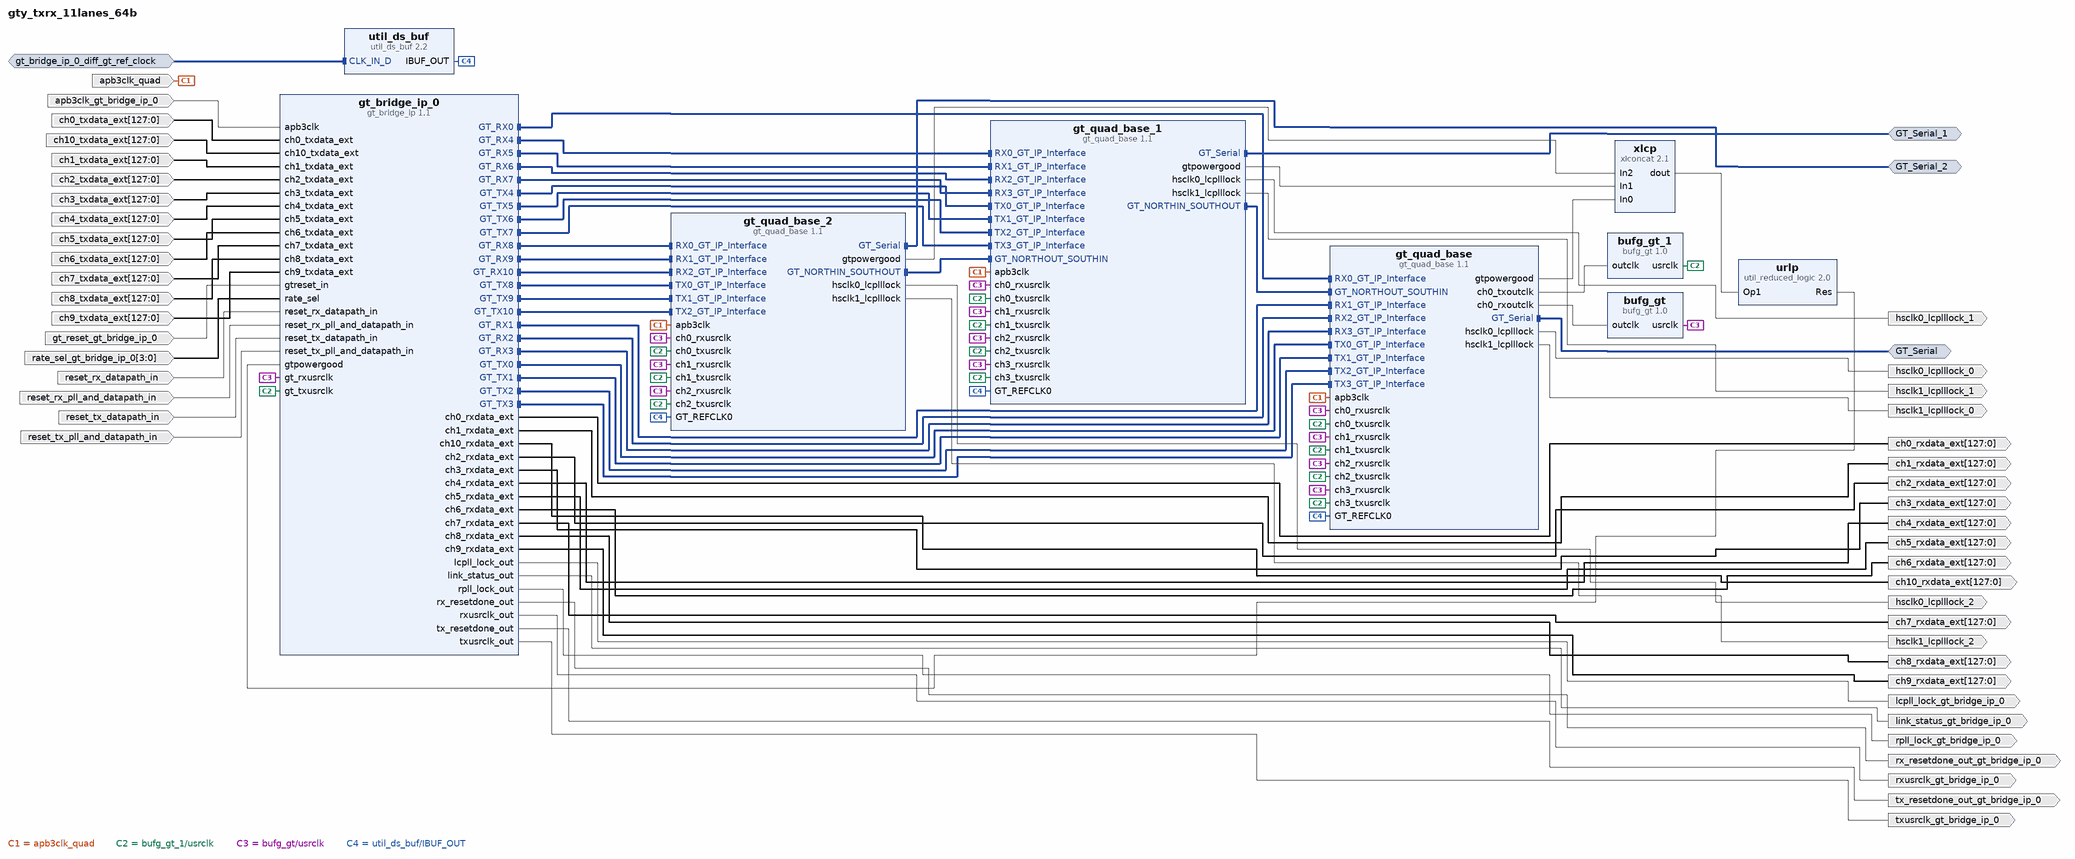
[diagram p0: block diagram of the top level]
# Vivado block design gty_txrx_11lanes_64b, xcvc1902-vsva2197-2MP-e-S, Vivado 2021.1
create_bd_design gty_txrx_11lanes_64b

create_bd_intf_port -mode Slave -vlnv xilinx.com:interface:diff_clock_rtl:1.0 gt_bridge_ip_0_diff_gt_ref_clock
set_property -dict {CONFIG.FREQ_HZ 200000000} [get_bd_intf_ports gt_bridge_ip_0_diff_gt_ref_clock]
create_bd_intf_port -mode Master -vlnv xilinx.com:interface:gt_rtl:1.0 GT_Serial
create_bd_intf_port -mode Master -vlnv xilinx.com:interface:gt_rtl:1.0 GT_Serial_1
create_bd_intf_port -mode Master -vlnv xilinx.com:interface:gt_rtl:1.0 GT_Serial_2
create_bd_port -dir I apb3clk_quad
create_bd_port -dir I gt_reset_gt_bridge_ip_0
create_bd_port -dir O link_status_gt_bridge_ip_0
create_bd_port -dir O txusrclk_gt_bridge_ip_0
create_bd_port -dir O rxusrclk_gt_bridge_ip_0
create_bd_port -dir O rpll_lock_gt_bridge_ip_0
create_bd_port -dir O lcpll_lock_gt_bridge_ip_0
create_bd_port -dir O tx_resetdone_out_gt_bridge_ip_0
create_bd_port -dir O rx_resetdone_out_gt_bridge_ip_0
create_bd_port -dir I -from 3 -to 0 rate_sel_gt_bridge_ip_0
create_bd_port -dir I apb3clk_gt_bridge_ip_0
create_bd_port -dir I reset_rx_pll_and_datapath_in
create_bd_port -dir I reset_rx_datapath_in
create_bd_port -dir I reset_tx_pll_and_datapath_in
create_bd_port -dir I reset_tx_datapath_in
create_bd_port -dir O -from 127 -to 0 ch0_rxdata_ext
create_bd_port -dir I -from 127 -to 0 ch0_txdata_ext
create_bd_port -dir O -from 127 -to 0 ch1_rxdata_ext
create_bd_port -dir I -from 127 -to 0 ch1_txdata_ext
create_bd_port -dir O -from 127 -to 0 ch2_rxdata_ext
create_bd_port -dir I -from 127 -to 0 ch2_txdata_ext
create_bd_port -dir O -from 127 -to 0 ch3_rxdata_ext
create_bd_port -dir I -from 127 -to 0 ch3_txdata_ext
create_bd_port -dir O -from 127 -to 0 ch4_rxdata_ext
create_bd_port -dir I -from 127 -to 0 ch4_txdata_ext
create_bd_port -dir O -from 127 -to 0 ch5_rxdata_ext
create_bd_port -dir I -from 127 -to 0 ch5_txdata_ext
create_bd_port -dir O -from 127 -to 0 ch6_rxdata_ext
create_bd_port -dir I -from 127 -to 0 ch6_txdata_ext
create_bd_port -dir O -from 127 -to 0 ch7_rxdata_ext
create_bd_port -dir I -from 127 -to 0 ch7_txdata_ext
create_bd_port -dir O -from 127 -to 0 ch8_rxdata_ext
create_bd_port -dir I -from 127 -to 0 ch8_txdata_ext
create_bd_port -dir O -from 127 -to 0 ch9_rxdata_ext
create_bd_port -dir I -from 127 -to 0 ch9_txdata_ext
create_bd_port -dir O -from 127 -to 0 ch10_rxdata_ext
create_bd_port -dir I -from 127 -to 0 ch10_txdata_ext
create_bd_port -dir O hsclk0_lcplllock_0
create_bd_port -dir O hsclk1_lcplllock_0
create_bd_port -dir O hsclk0_lcplllock_1
create_bd_port -dir O hsclk1_lcplllock_1
create_bd_port -dir O hsclk0_lcplllock_2
create_bd_port -dir O hsclk1_lcplllock_2

create_bd_cell -type ip -vlnv xilinx.com:ip:gt_bridge_ip:1.1 gt_bridge_ip_0
set_property -dict [list \
  CONFIG.BYPASS_MODE true \
  CONFIG.IP_LR0_SETTINGS {PRESET None RX_PAM_SEL NRZ TX_PAM_SEL NRZ RX_GRAY_BYP true TX_GRAY_BYP true RX_GRAY_LITTLEENDIAN true TX_GRAY_LITTLEENDIAN true RX_PRECODE_BYP true TX_PRECODE_BYP true RX_PRECODE_LITTLEENDIAN false TX_PRECODE_LITTLEENDIAN false INTERNAL_PRESET None GT_TYPE GTY GT_DIRECTION DUPLEX TX_LINE_RATE 12.8 TX_PLL_TYPE LCPLL TX_REFCLK_FREQUENCY 200.0 TX_ACTUAL_REFCLK_FREQUENCY 200.000000000000 TX_FRACN_ENABLED false TX_FRACN_NUMERATOR 0 TX_REFCLK_SOURCE R0 TX_DATA_ENCODING RAW TX_USER_DATA_WIDTH 64 TX_INT_DATA_WIDTH 64 TX_BUFFER_MODE 1 TX_BUFFER_BYPASS_MODE Fast_Sync TX_PIPM_ENABLE false TX_OUTCLK_SOURCE TXOUTCLKPMA TXPROGDIV_FREQ_ENABLE false TXPROGDIV_FREQ_SOURCE LCPLL TXPROGDIV_FREQ_VAL 322.265625 TX_DIFF_SWING_EMPH_MODE CUSTOM TX_64B66B_SCRAMBLER false TX_64B66B_ENCODER false TX_64B66B_CRC false TX_RATE_GROUP A RX_LINE_RATE 12.8 RX_PLL_TYPE LCPLL RX_REFCLK_FREQUENCY 200.0 RX_ACTUAL_REFCLK_FREQUENCY 200.000000000000 RX_FRACN_ENABLED false RX_FRACN_NUMERATOR 0 RX_REFCLK_SOURCE R0 RX_DATA_DECODING RAW RX_USER_DATA_WIDTH 64 RX_INT_DATA_WIDTH 64 RX_BUFFER_MODE 1 RX_OUTCLK_SOURCE RXOUTCLKPMA RXPROGDIV_FREQ_ENABLE false RXPROGDIV_FREQ_SOURCE LCPLL RXPROGDIV_FREQ_VAL 322.265625 INS_LOSS_NYQ 20 RX_EQ_MODE AUTO RX_COUPLING AC RX_TERMINATION PROGRAMMABLE RX_RATE_GROUP A RX_TERMINATION_PROG_VALUE 800 RX_PPM_OFFSET 0 RX_64B66B_DESCRAMBLER false RX_64B66B_DECODER false RX_64B66B_CRC false OOB_ENABLE false RX_COMMA_ALIGN_WORD 1 RX_COMMA_SHOW_REALIGN_ENABLE true PCIE_ENABLE false TX_LANE_DESKEW_HDMI_ENABLE false RX_COMMA_P_ENABLE false RX_COMMA_M_ENABLE false RX_COMMA_DOUBLE_ENABLE false RX_COMMA_P_VAL 0101111100 RX_COMMA_M_VAL 1010000011 RX_COMMA_MASK 0000000000 RX_SLIDE_MODE OFF RX_SSC_PPM 0 RX_CB_NUM_SEQ 0 RX_CB_LEN_SEQ 1 RX_CB_MAX_SKEW 1 RX_CB_MAX_LEVEL 1 RX_CB_MASK_0_0 false RX_CB_VAL_0_0 00000000 RX_CB_K_0_0 false RX_CB_DISP_0_0 false RX_CB_MASK_0_1 false RX_CB_VAL_0_1 00000000 RX_CB_K_0_1 false RX_CB_DISP_0_1 false RX_CB_MASK_0_2 false RX_CB_VAL_0_2 00000000 RX_CB_K_0_2 false RX_CB_DISP_0_2 false RX_CB_MASK_0_3 false RX_CB_VAL_0_3 00000000 RX_CB_K_0_3 false RX_CB_DISP_0_3 false RX_CB_MASK_1_0 false RX_CB_VAL_1_0 00000000 RX_CB_K_1_0 false RX_CB_DISP_1_0 false RX_CB_MASK_1_1 false RX_CB_VAL_1_1 00000000 RX_CB_K_1_1 false RX_CB_DISP_1_1 false RX_CB_MASK_1_2 false RX_CB_VAL_1_2 00000000 RX_CB_K_1_2 false RX_CB_DISP_1_2 false RX_CB_MASK_1_3 false RX_CB_VAL_1_3 00000000 RX_CB_K_1_3 false RX_CB_DISP_1_3 false RX_CC_NUM_SEQ 0 RX_CC_LEN_SEQ 1 RX_CC_PERIODICITY 5000 RX_CC_KEEP_IDLE DISABLE RX_CC_PRECEDENCE ENABLE RX_CC_REPEAT_WAIT 0 RX_CC_VAL 00000000000000000000000000000000000000000000000000000000000000000000000000000000 RX_CC_MASK_0_0 false RX_CC_VAL_0_0 00000000 RX_CC_K_0_0 false RX_CC_DISP_0_0 false RX_CC_MASK_0_1 false RX_CC_VAL_0_1 00000000 RX_CC_K_0_1 false RX_CC_DISP_0_1 false RX_CC_MASK_0_2 false RX_CC_VAL_0_2 00000000 RX_CC_K_0_2 false RX_CC_DISP_0_2 false RX_CC_MASK_0_3 false RX_CC_VAL_0_3 00000000 RX_CC_K_0_3 false RX_CC_DISP_0_3 false RX_CC_MASK_1_0 false RX_CC_VAL_1_0 00000000 RX_CC_K_1_0 false RX_CC_DISP_1_0 false RX_CC_MASK_1_1 false RX_CC_VAL_1_1 00000000 RX_CC_K_1_1 false RX_CC_DISP_1_1 false RX_CC_MASK_1_2 false RX_CC_VAL_1_2 00000000 RX_CC_K_1_2 false RX_CC_DISP_1_2 false RX_CC_MASK_1_3 false RX_CC_VAL_1_3 00000000 RX_CC_K_1_3 false RX_CC_DISP_1_3 false PCIE_USERCLK2_FREQ 250 PCIE_USERCLK_FREQ 250 RX_JTOL_FC 7.6784643 RX_JTOL_LF_SLOPE -20 RX_BUFFER_BYPASS_MODE Fast_Sync RX_BUFFER_BYPASS_MODE_LANE MULTI RX_BUFFER_RESET_ON_CB_CHANGE ENABLE RX_BUFFER_RESET_ON_COMMAALIGN DISABLE RX_BUFFER_RESET_ON_RATE_CHANGE ENABLE TX_BUFFER_RESET_ON_RATE_CHANGE ENABLE RESET_SEQUENCE_INTERVAL 0 RX_COMMA_PRESET NONE RX_COMMA_VALID_ONLY 0 } \
  CONFIG.IP_NO_OF_LANES 11 \
] [get_bd_cells gt_bridge_ip_0]
create_bd_cell -type ip -vlnv xilinx.com:ip:gt_quad_base:1.1 gt_quad_base
set_property -dict [list \
  CONFIG.PORTS_INFO_DICT {LANE_SEL_DICT {PROT0 {RX0 RX1 RX2 RX3 TX0 TX1 TX2 TX3}} GT_TYPE GTY REG_CONF_INTF APB3_INTF BOARD_PARAMETER { }} \
  CONFIG.QUAD_USAGE {TX_QUAD_CH {TXQuad_0_/gt_quad_base {/gt_quad_base gty_txrx_11lanes_64b_gt_bridge_ip_0_0.IP_CH0,gty_txrx_11lanes_64b_gt_bridge_ip_0_0.IP_CH1,gty_txrx_11lanes_64b_gt_bridge_ip_0_0.IP_CH2,gty_txrx_11lanes_64b_gt_bridge_ip_0_0.IP_CH3 MSTRCLK 1,0,0,0 IS_CURRENT_QUAD 1} TXQuad_1_/gt_quad_base_1 {/gt_quad_base_1 gty_txrx_11lanes_64b_gt_bridge_ip_0_0.IP_CH4,gty_txrx_11lanes_64b_gt_bridge_ip_0_0.IP_CH5,gty_txrx_11lanes_64b_gt_bridge_ip_0_0.IP_CH6,gty_txrx_11lanes_64b_gt_bridge_ip_0_0.IP_CH7 MSTRCLK 0,0,0,0 IS_CURRENT_QUAD 0} TXQuad_2_/gt_quad_base_2 {/gt_quad_base_2 gty_txrx_11lanes_64b_gt_bridge_ip_0_0.IP_CH8,gty_txrx_11lanes_64b_gt_bridge_ip_0_0.IP_CH9,gty_txrx_11lanes_64b_gt_bridge_ip_0_0.IP_CH10,undef MSTRCLK 0,0,0,0 IS_CURRENT_QUAD 0}} RX_QUAD_CH {RXQuad_0_/gt_quad_base {/gt_quad_base gty_txrx_11lanes_64b_gt_bridge_ip_0_0.IP_CH0,gty_txrx_11lanes_64b_gt_bridge_ip_0_0.IP_CH1,gty_txrx_11lanes_64b_gt_bridge_ip_0_0.IP_CH2,gty_txrx_11lanes_64b_gt_bridge_ip_0_0.IP_CH3 MSTRCLK 1,0,0,0 IS_CURRENT_QUAD 1} RXQuad_1_/gt_quad_base_1 {/gt_quad_base_1 gty_txrx_11lanes_64b_gt_bridge_ip_0_0.IP_CH4,gty_txrx_11lanes_64b_gt_bridge_ip_0_0.IP_CH5,gty_txrx_11lanes_64b_gt_bridge_ip_0_0.IP_CH6,gty_txrx_11lanes_64b_gt_bridge_ip_0_0.IP_CH7 MSTRCLK 0,0,0,0 IS_CURRENT_QUAD 0} RXQuad_2_/gt_quad_base_2 {/gt_quad_base_2 gty_txrx_11lanes_64b_gt_bridge_ip_0_0.IP_CH8,gty_txrx_11lanes_64b_gt_bridge_ip_0_0.IP_CH9,gty_txrx_11lanes_64b_gt_bridge_ip_0_0.IP_CH10,undef MSTRCLK 0,0,0,0 IS_CURRENT_QUAD 0}}} \
  CONFIG.REFCLK_STRING {HSCLK0_LCPLLGTREFCLK0 refclk_PROT0_R0_200_MHz_unique1 HSCLK1_LCPLLGTREFCLK0 refclk_PROT0_R0_200_MHz_unique1} \
] [get_bd_cells gt_quad_base]
create_bd_cell -type ip -vlnv xilinx.com:ip:gt_quad_base:1.1 gt_quad_base_1
set_property -dict [list \
  CONFIG.PORTS_INFO_DICT {LANE_SEL_DICT {PROT0 {RX0 RX1 RX2 RX3 TX0 TX1 TX2 TX3}} GT_TYPE GTY REG_CONF_INTF APB3_INTF BOARD_PARAMETER { }} \
  CONFIG.QUAD_USAGE {TX_QUAD_CH {TXQuad_-1_/gt_quad_base {/gt_quad_base gty_txrx_11lanes_64b_gt_bridge_ip_0_0.IP_CH0,gty_txrx_11lanes_64b_gt_bridge_ip_0_0.IP_CH1,gty_txrx_11lanes_64b_gt_bridge_ip_0_0.IP_CH2,gty_txrx_11lanes_64b_gt_bridge_ip_0_0.IP_CH3 MSTRCLK 1,0,0,0 IS_CURRENT_QUAD 0} TXQuad_0_/gt_quad_base_1 {/gt_quad_base_1 gty_txrx_11lanes_64b_gt_bridge_ip_0_0.IP_CH4,gty_txrx_11lanes_64b_gt_bridge_ip_0_0.IP_CH5,gty_txrx_11lanes_64b_gt_bridge_ip_0_0.IP_CH6,gty_txrx_11lanes_64b_gt_bridge_ip_0_0.IP_CH7 MSTRCLK 0,0,0,0 IS_CURRENT_QUAD 1} TXQuad_1_/gt_quad_base_2 {/gt_quad_base_2 gty_txrx_11lanes_64b_gt_bridge_ip_0_0.IP_CH8,gty_txrx_11lanes_64b_gt_bridge_ip_0_0.IP_CH9,gty_txrx_11lanes_64b_gt_bridge_ip_0_0.IP_CH10,undef MSTRCLK 0,0,0,0 IS_CURRENT_QUAD 0}} RX_QUAD_CH {RXQuad_-1_/gt_quad_base {/gt_quad_base gty_txrx_11lanes_64b_gt_bridge_ip_0_0.IP_CH0,gty_txrx_11lanes_64b_gt_bridge_ip_0_0.IP_CH1,gty_txrx_11lanes_64b_gt_bridge_ip_0_0.IP_CH2,gty_txrx_11lanes_64b_gt_bridge_ip_0_0.IP_CH3 MSTRCLK 1,0,0,0 IS_CURRENT_QUAD 0} RXQuad_0_/gt_quad_base_1 {/gt_quad_base_1 gty_txrx_11lanes_64b_gt_bridge_ip_0_0.IP_CH4,gty_txrx_11lanes_64b_gt_bridge_ip_0_0.IP_CH5,gty_txrx_11lanes_64b_gt_bridge_ip_0_0.IP_CH6,gty_txrx_11lanes_64b_gt_bridge_ip_0_0.IP_CH7 MSTRCLK 0,0,0,0 IS_CURRENT_QUAD 1} RXQuad_1_/gt_quad_base_2 {/gt_quad_base_2 gty_txrx_11lanes_64b_gt_bridge_ip_0_0.IP_CH8,gty_txrx_11lanes_64b_gt_bridge_ip_0_0.IP_CH9,gty_txrx_11lanes_64b_gt_bridge_ip_0_0.IP_CH10,undef MSTRCLK 0,0,0,0 IS_CURRENT_QUAD 0}}} \
  CONFIG.REFCLK_STRING {HSCLK0_LCPLLGTREFCLK0 refclk_PROT0_R0_200_MHz_unique1 HSCLK1_LCPLLGTREFCLK0 refclk_PROT0_R0_200_MHz_unique1} \
] [get_bd_cells gt_quad_base_1]
create_bd_cell -type ip -vlnv xilinx.com:ip:gt_quad_base:1.1 gt_quad_base_2
set_property -dict [list \
  CONFIG.PORTS_INFO_DICT {LANE_SEL_DICT {PROT0 {RX0 RX1 RX2 TX0 TX1 TX2} unconnected {RX3 TX3}} GT_TYPE GTY REG_CONF_INTF APB3_INTF BOARD_PARAMETER { }} \
  CONFIG.QUAD_USAGE {TX_QUAD_CH {TXQuad_-2_/gt_quad_base {/gt_quad_base gty_txrx_11lanes_64b_gt_bridge_ip_0_0.IP_CH0,gty_txrx_11lanes_64b_gt_bridge_ip_0_0.IP_CH1,gty_txrx_11lanes_64b_gt_bridge_ip_0_0.IP_CH2,gty_txrx_11lanes_64b_gt_bridge_ip_0_0.IP_CH3 MSTRCLK 1,0,0,0 IS_CURRENT_QUAD 0} TXQuad_-1_/gt_quad_base_1 {/gt_quad_base_1 gty_txrx_11lanes_64b_gt_bridge_ip_0_0.IP_CH4,gty_txrx_11lanes_64b_gt_bridge_ip_0_0.IP_CH5,gty_txrx_11lanes_64b_gt_bridge_ip_0_0.IP_CH6,gty_txrx_11lanes_64b_gt_bridge_ip_0_0.IP_CH7 MSTRCLK 0,0,0,0 IS_CURRENT_QUAD 0} TXQuad_0_/gt_quad_base_2 {/gt_quad_base_2 gty_txrx_11lanes_64b_gt_bridge_ip_0_0.IP_CH8,gty_txrx_11lanes_64b_gt_bridge_ip_0_0.IP_CH9,gty_txrx_11lanes_64b_gt_bridge_ip_0_0.IP_CH10,undef MSTRCLK 0,0,0,0 IS_CURRENT_QUAD 1}} RX_QUAD_CH {RXQuad_-2_/gt_quad_base {/gt_quad_base gty_txrx_11lanes_64b_gt_bridge_ip_0_0.IP_CH0,gty_txrx_11lanes_64b_gt_bridge_ip_0_0.IP_CH1,gty_txrx_11lanes_64b_gt_bridge_ip_0_0.IP_CH2,gty_txrx_11lanes_64b_gt_bridge_ip_0_0.IP_CH3 MSTRCLK 1,0,0,0 IS_CURRENT_QUAD 0} RXQuad_-1_/gt_quad_base_1 {/gt_quad_base_1 gty_txrx_11lanes_64b_gt_bridge_ip_0_0.IP_CH4,gty_txrx_11lanes_64b_gt_bridge_ip_0_0.IP_CH5,gty_txrx_11lanes_64b_gt_bridge_ip_0_0.IP_CH6,gty_txrx_11lanes_64b_gt_bridge_ip_0_0.IP_CH7 MSTRCLK 0,0,0,0 IS_CURRENT_QUAD 0} RXQuad_0_/gt_quad_base_2 {/gt_quad_base_2 gty_txrx_11lanes_64b_gt_bridge_ip_0_0.IP_CH8,gty_txrx_11lanes_64b_gt_bridge_ip_0_0.IP_CH9,gty_txrx_11lanes_64b_gt_bridge_ip_0_0.IP_CH10,undef MSTRCLK 0,0,0,0 IS_CURRENT_QUAD 1}}} \
  CONFIG.REFCLK_STRING {HSCLK0_LCPLLGTREFCLK0 refclk_PROT0_R0_200_MHz_unique1 HSCLK1_LCPLLGTREFCLK0 refclk_PROT0_R0_200_MHz_unique1} \
] [get_bd_cells gt_quad_base_2]
create_bd_cell -type ip -vlnv xilinx.com:ip:bufg_gt:1.0 bufg_gt
create_bd_cell -type ip -vlnv xilinx.com:ip:bufg_gt:1.0 bufg_gt_1
create_bd_cell -type ip -vlnv xilinx.com:ip:util_reduced_logic:2.0 urlp
set_property -dict {CONFIG.C_SIZE 3} [get_bd_cells urlp]
create_bd_cell -type ip -vlnv xilinx.com:ip:xlconcat:2.1 xlcp
set_property -dict {CONFIG.NUM_PORTS 3} [get_bd_cells xlcp]
create_bd_cell -type ip -vlnv xilinx.com:ip:util_ds_buf:2.2 util_ds_buf
set_property -dict {CONFIG.C_BUF_TYPE IBUFDSGTE} [get_bd_cells util_ds_buf]

# ---- connections ----

connect_bd_intf_net [get_bd_intf_pins gt_bridge_ip_0/GT_RX0] [get_bd_intf_pins gt_quad_base/RX0_GT_IP_Interface]
connect_bd_intf_net [get_bd_intf_pins gt_bridge_ip_0/GT_RX1] [get_bd_intf_pins gt_quad_base/RX1_GT_IP_Interface]
connect_bd_intf_net [get_bd_intf_pins gt_bridge_ip_0/GT_RX2] [get_bd_intf_pins gt_quad_base/RX2_GT_IP_Interface]
connect_bd_intf_net [get_bd_intf_pins gt_bridge_ip_0/GT_RX3] [get_bd_intf_pins gt_quad_base/RX3_GT_IP_Interface]
connect_bd_intf_net [get_bd_intf_pins gt_bridge_ip_0/GT_RX4] [get_bd_intf_pins gt_quad_base_1/RX0_GT_IP_Interface]
connect_bd_intf_net [get_bd_intf_pins gt_bridge_ip_0/GT_RX5] [get_bd_intf_pins gt_quad_base_1/RX1_GT_IP_Interface]
connect_bd_intf_net [get_bd_intf_pins gt_bridge_ip_0/GT_RX6] [get_bd_intf_pins gt_quad_base_1/RX2_GT_IP_Interface]
connect_bd_intf_net [get_bd_intf_pins gt_bridge_ip_0/GT_RX7] [get_bd_intf_pins gt_quad_base_1/RX3_GT_IP_Interface]
connect_bd_intf_net [get_bd_intf_pins gt_bridge_ip_0/GT_RX8] [get_bd_intf_pins gt_quad_base_2/RX0_GT_IP_Interface]
connect_bd_intf_net [get_bd_intf_pins gt_bridge_ip_0/GT_RX9] [get_bd_intf_pins gt_quad_base_2/RX1_GT_IP_Interface]
connect_bd_intf_net [get_bd_intf_pins gt_bridge_ip_0/GT_RX10] [get_bd_intf_pins gt_quad_base_2/RX2_GT_IP_Interface]
connect_bd_intf_net [get_bd_intf_pins gt_bridge_ip_0/GT_TX0] [get_bd_intf_pins gt_quad_base/TX0_GT_IP_Interface]
connect_bd_intf_net [get_bd_intf_pins gt_bridge_ip_0/GT_TX1] [get_bd_intf_pins gt_quad_base/TX1_GT_IP_Interface]
connect_bd_intf_net [get_bd_intf_pins gt_bridge_ip_0/GT_TX2] [get_bd_intf_pins gt_quad_base/TX2_GT_IP_Interface]
connect_bd_intf_net [get_bd_intf_pins gt_bridge_ip_0/GT_TX3] [get_bd_intf_pins gt_quad_base/TX3_GT_IP_Interface]
connect_bd_intf_net [get_bd_intf_pins gt_bridge_ip_0/GT_TX4] [get_bd_intf_pins gt_quad_base_1/TX0_GT_IP_Interface]
connect_bd_intf_net [get_bd_intf_pins gt_bridge_ip_0/GT_TX5] [get_bd_intf_pins gt_quad_base_1/TX1_GT_IP_Interface]
connect_bd_intf_net [get_bd_intf_pins gt_bridge_ip_0/GT_TX6] [get_bd_intf_pins gt_quad_base_1/TX2_GT_IP_Interface]
connect_bd_intf_net [get_bd_intf_pins gt_bridge_ip_0/GT_TX7] [get_bd_intf_pins gt_quad_base_1/TX3_GT_IP_Interface]
connect_bd_intf_net [get_bd_intf_pins gt_bridge_ip_0/GT_TX8] [get_bd_intf_pins gt_quad_base_2/TX0_GT_IP_Interface]
connect_bd_intf_net [get_bd_intf_pins gt_bridge_ip_0/GT_TX9] [get_bd_intf_pins gt_quad_base_2/TX1_GT_IP_Interface]
connect_bd_intf_net [get_bd_intf_pins gt_bridge_ip_0/GT_TX10] [get_bd_intf_pins gt_quad_base_2/TX2_GT_IP_Interface]
connect_bd_intf_net [get_bd_intf_ports gt_bridge_ip_0_diff_gt_ref_clock] [get_bd_intf_pins util_ds_buf/CLK_IN_D]
connect_bd_intf_net [get_bd_intf_pins gt_quad_base/GT_NORTHOUT_SOUTHIN] [get_bd_intf_pins gt_quad_base_1/GT_NORTHIN_SOUTHOUT]
connect_bd_intf_net [get_bd_intf_ports GT_Serial_1] [get_bd_intf_pins gt_quad_base_1/GT_Serial]
connect_bd_intf_net [get_bd_intf_pins gt_quad_base_1/GT_NORTHOUT_SOUTHIN] [get_bd_intf_pins gt_quad_base_2/GT_NORTHIN_SOUTHOUT]
connect_bd_intf_net [get_bd_intf_ports GT_Serial_2] [get_bd_intf_pins gt_quad_base_2/GT_Serial]
connect_bd_intf_net [get_bd_intf_ports GT_Serial] [get_bd_intf_pins gt_quad_base/GT_Serial]
connect_bd_net -net apb3clk_gt_bridge_ip_0_1 [get_bd_ports apb3clk_gt_bridge_ip_0] [get_bd_pins gt_bridge_ip_0/apb3clk]
connect_bd_net [get_bd_ports apb3clk_quad] \
  [get_bd_pins gt_quad_base/apb3clk] [get_bd_pins gt_quad_base_1/apb3clk] [get_bd_pins gt_quad_base_2/apb3clk]
connect_bd_net [get_bd_pins bufg_gt_1/usrclk] \
  [get_bd_pins gt_bridge_ip_0/gt_txusrclk] [get_bd_pins gt_quad_base/ch0_txusrclk] [get_bd_pins gt_quad_base/ch1_txusrclk] \
  [get_bd_pins gt_quad_base/ch2_txusrclk] [get_bd_pins gt_quad_base/ch3_txusrclk] [get_bd_pins gt_quad_base_1/ch0_txusrclk] \
  [get_bd_pins gt_quad_base_1/ch1_txusrclk] [get_bd_pins gt_quad_base_1/ch2_txusrclk] \
  [get_bd_pins gt_quad_base_1/ch3_txusrclk] [get_bd_pins gt_quad_base_2/ch0_txusrclk] \
  [get_bd_pins gt_quad_base_2/ch1_txusrclk] [get_bd_pins gt_quad_base_2/ch2_txusrclk]
connect_bd_net [get_bd_pins bufg_gt/usrclk] \
  [get_bd_pins gt_bridge_ip_0/gt_rxusrclk] [get_bd_pins gt_quad_base/ch0_rxusrclk] [get_bd_pins gt_quad_base/ch1_rxusrclk] \
  [get_bd_pins gt_quad_base/ch2_rxusrclk] [get_bd_pins gt_quad_base/ch3_rxusrclk] [get_bd_pins gt_quad_base_1/ch0_rxusrclk] \
  [get_bd_pins gt_quad_base_1/ch1_rxusrclk] [get_bd_pins gt_quad_base_1/ch2_rxusrclk] \
  [get_bd_pins gt_quad_base_1/ch3_rxusrclk] [get_bd_pins gt_quad_base_2/ch0_rxusrclk] \
  [get_bd_pins gt_quad_base_2/ch1_rxusrclk] [get_bd_pins gt_quad_base_2/ch2_rxusrclk]
connect_bd_net [get_bd_ports ch0_txdata_ext] [get_bd_pins gt_bridge_ip_0/ch0_txdata_ext]
connect_bd_net [get_bd_ports ch10_txdata_ext] [get_bd_pins gt_bridge_ip_0/ch10_txdata_ext]
connect_bd_net [get_bd_ports ch1_txdata_ext] [get_bd_pins gt_bridge_ip_0/ch1_txdata_ext]
connect_bd_net [get_bd_ports ch2_txdata_ext] [get_bd_pins gt_bridge_ip_0/ch2_txdata_ext]
connect_bd_net [get_bd_ports ch3_txdata_ext] [get_bd_pins gt_bridge_ip_0/ch3_txdata_ext]
connect_bd_net [get_bd_ports ch4_txdata_ext] [get_bd_pins gt_bridge_ip_0/ch4_txdata_ext]
connect_bd_net [get_bd_ports ch5_txdata_ext] [get_bd_pins gt_bridge_ip_0/ch5_txdata_ext]
connect_bd_net [get_bd_ports ch6_txdata_ext] [get_bd_pins gt_bridge_ip_0/ch6_txdata_ext]
connect_bd_net [get_bd_ports ch7_txdata_ext] [get_bd_pins gt_bridge_ip_0/ch7_txdata_ext]
connect_bd_net [get_bd_ports ch8_txdata_ext] [get_bd_pins gt_bridge_ip_0/ch8_txdata_ext]
connect_bd_net [get_bd_ports ch9_txdata_ext] [get_bd_pins gt_bridge_ip_0/ch9_txdata_ext]
connect_bd_net [get_bd_pins gt_bridge_ip_0/ch0_rxdata_ext] [get_bd_ports ch0_rxdata_ext]
connect_bd_net [get_bd_pins gt_bridge_ip_0/ch10_rxdata_ext] [get_bd_ports ch10_rxdata_ext]
connect_bd_net [get_bd_pins gt_bridge_ip_0/ch1_rxdata_ext] [get_bd_ports ch1_rxdata_ext]
connect_bd_net [get_bd_pins gt_bridge_ip_0/ch2_rxdata_ext] [get_bd_ports ch2_rxdata_ext]
connect_bd_net [get_bd_pins gt_bridge_ip_0/ch3_rxdata_ext] [get_bd_ports ch3_rxdata_ext]
connect_bd_net [get_bd_pins gt_bridge_ip_0/ch4_rxdata_ext] [get_bd_ports ch4_rxdata_ext]
connect_bd_net [get_bd_pins gt_bridge_ip_0/ch5_rxdata_ext] [get_bd_ports ch5_rxdata_ext]
connect_bd_net [get_bd_pins gt_bridge_ip_0/ch6_rxdata_ext] [get_bd_ports ch6_rxdata_ext]
connect_bd_net [get_bd_pins gt_bridge_ip_0/ch7_rxdata_ext] [get_bd_ports ch7_rxdata_ext]
connect_bd_net [get_bd_pins gt_bridge_ip_0/ch8_rxdata_ext] [get_bd_ports ch8_rxdata_ext]
connect_bd_net [get_bd_pins gt_bridge_ip_0/ch9_rxdata_ext] [get_bd_ports ch9_rxdata_ext]
connect_bd_net [get_bd_pins gt_bridge_ip_0/lcpll_lock_out] [get_bd_ports lcpll_lock_gt_bridge_ip_0]
connect_bd_net [get_bd_pins gt_bridge_ip_0/link_status_out] [get_bd_ports link_status_gt_bridge_ip_0]
connect_bd_net [get_bd_pins gt_bridge_ip_0/rpll_lock_out] [get_bd_ports rpll_lock_gt_bridge_ip_0]
connect_bd_net [get_bd_pins gt_bridge_ip_0/rx_resetdone_out] [get_bd_ports rx_resetdone_out_gt_bridge_ip_0]
connect_bd_net [get_bd_pins gt_bridge_ip_0/rxusrclk_out] [get_bd_ports rxusrclk_gt_bridge_ip_0]
connect_bd_net [get_bd_pins gt_bridge_ip_0/tx_resetdone_out] [get_bd_ports tx_resetdone_out_gt_bridge_ip_0]
connect_bd_net [get_bd_pins gt_bridge_ip_0/txusrclk_out] [get_bd_ports txusrclk_gt_bridge_ip_0]
connect_bd_net [get_bd_pins gt_quad_base_1/gtpowergood] [get_bd_pins xlcp/In1]
connect_bd_net [get_bd_pins gt_quad_base_1/hsclk0_lcplllock] [get_bd_ports hsclk0_lcplllock_1]
connect_bd_net [get_bd_pins gt_quad_base_1/hsclk1_lcplllock] [get_bd_ports hsclk1_lcplllock_1]
connect_bd_net [get_bd_pins gt_quad_base_2/gtpowergood] [get_bd_pins xlcp/In2]
connect_bd_net [get_bd_pins gt_quad_base_2/hsclk0_lcplllock] [get_bd_ports hsclk0_lcplllock_2]
connect_bd_net [get_bd_pins gt_quad_base_2/hsclk1_lcplllock] [get_bd_ports hsclk1_lcplllock_2]
connect_bd_net [get_bd_pins gt_quad_base/ch0_rxoutclk] [get_bd_pins bufg_gt/outclk]
connect_bd_net [get_bd_pins gt_quad_base/ch0_txoutclk] [get_bd_pins bufg_gt_1/outclk]
connect_bd_net [get_bd_pins gt_quad_base/gtpowergood] [get_bd_pins xlcp/In0]
connect_bd_net [get_bd_pins gt_quad_base/hsclk0_lcplllock] [get_bd_ports hsclk0_lcplllock_0]
connect_bd_net [get_bd_pins gt_quad_base/hsclk1_lcplllock] [get_bd_ports hsclk1_lcplllock_0]
connect_bd_net -net gt_reset_gt_bridge_ip_0_1 [get_bd_ports gt_reset_gt_bridge_ip_0] [get_bd_pins gt_bridge_ip_0/gtreset_in]
connect_bd_net -net rate_sel_gt_bridge_ip_0_1 [get_bd_ports rate_sel_gt_bridge_ip_0] [get_bd_pins gt_bridge_ip_0/rate_sel]
connect_bd_net [get_bd_ports reset_rx_datapath_in] [get_bd_pins gt_bridge_ip_0/reset_rx_datapath_in]
connect_bd_net [get_bd_ports reset_rx_pll_and_datapath_in] [get_bd_pins gt_bridge_ip_0/reset_rx_pll_and_datapath_in]
connect_bd_net [get_bd_ports reset_tx_datapath_in] [get_bd_pins gt_bridge_ip_0/reset_tx_datapath_in]
connect_bd_net [get_bd_ports reset_tx_pll_and_datapath_in] [get_bd_pins gt_bridge_ip_0/reset_tx_pll_and_datapath_in]
connect_bd_net [get_bd_pins urlp/Res] [get_bd_pins gt_bridge_ip_0/gtpowergood]
connect_bd_net [get_bd_pins util_ds_buf/IBUF_OUT] \
  [get_bd_pins gt_quad_base/GT_REFCLK0] [get_bd_pins gt_quad_base_1/GT_REFCLK0] [get_bd_pins gt_quad_base_2/GT_REFCLK0]
connect_bd_net [get_bd_pins xlcp/dout] [get_bd_pins urlp/Op1]

validate_bd_design
save_bd_design
